# Altium project Board_Board.PrjPcb
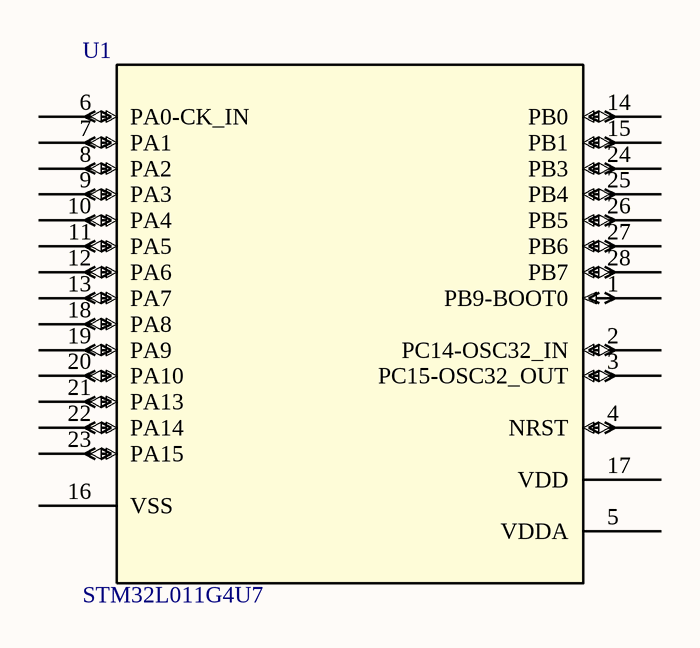
[diagram p0: Micro.SchDoc]
9 sheets, 1 parts. Net scope: global (net labels, ports and power ports of the same name join across sheets).
Sheets:
  Micro.SchDoc
  Load Cells.SchDoc
  Power.SchDoc
  Connectors.SchDoc
  Score Display.SchDoc
  LCD Display.SchDoc
  Radio.SchDoc
  Color Sensor.SchDoc
  Control Panel.SchDoc

## Sheet Micro.SchDoc
size A; SheetNumber: 1; SheetTotal: 9

### Parts
U1  STM32L011G4U7  [UFQFPN28-4x4mm]

### Nets

Not connected (* = marked no-connect by the designer): U1 1(PB9-BOOT0) 2(PC14-OSC32_IN) 3(PC15-OSC32_OUT) 4(NRST) 5(VDDA) 6(PA0-CK_IN) 7(PA1) 8(PA2) 9(PA3) 10(PA4) 11(PA5) 12(PA6) 13(PA7) 14(PB0) 15(PB1) 16(VSS) 17(VDD) 18(PA8) 19(PA9) 20(PA10) 21(PA13) 22(PA14) 23(PA15) 24(PB3) 25(PB4) 26(PB5) 27(PB6) 28(PB7)

### Library data of the parts
U1 = STM32L011G4U7: No Description Available; Mfr_Name: STMicroelectronics; Copyright: Copyright (C) 2022 Ultra Librarian. All rights reserved.; Manufacturer_Part_Number: STM32L011G4U7; Digi-Key_Part_Number_1: STM32L011G4U7-ND; RefDes: RefDes; Type: DEV; Supplier 1: Digi-Key; Supplier Part Number 1: STM32L011G4U7-ND

## Sheet Load Cells.SchDoc
size A; SheetNumber: 2; SheetTotal: 2

## Sheet Power.SchDoc
size A; SheetNumber: 3; SheetTotal: 3

## Sheet Connectors.SchDoc
size A; SheetNumber: 4; SheetTotal: 4

## Sheet Score Display.SchDoc
size A; SheetNumber: 5; SheetTotal: 5

## Sheet LCD Display.SchDoc
size A; SheetNumber: 6; SheetTotal: 6

## Sheet Radio.SchDoc
size A; SheetNumber: 7; SheetTotal: 7

## Sheet Color Sensor.SchDoc
size A; SheetNumber: 8; SheetTotal: 8

## Sheet Control Panel.SchDoc
size A; SheetNumber: 9; SheetTotal: 9